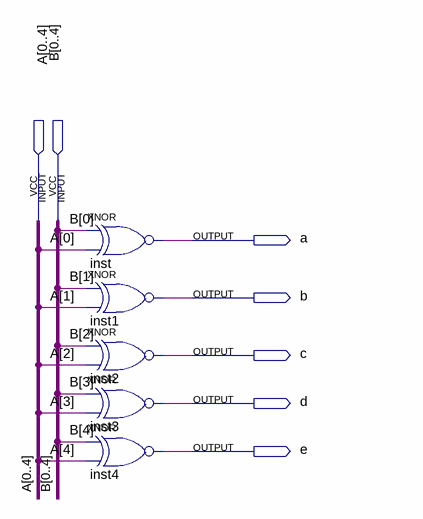
[diagram p0: schematic sheet]
// Quartus schematic AxnorB.bdf as structural Verilog: 5 symbols, 7 pins
module AxnorB (
  input  [0:4] A,
  input  [0:4] B,
  output A_1bit,
  output B_1bit,
  output c,
  output d,
  output e
);

  xnor inst (A_1bit, B[0], A[0]);
  xnor inst1 (B_1bit, B[1], A[1]);
  xnor inst2 (c, B[2], A[2]);
  xnor inst3 (d, B[3], A[3]);
  xnor inst4 (e, B[4], A[4]);
endmodule
